# EasyEDA Pro project OV-Watch_V2.4_LCProject_2024-05-25.epro, schematic back

## Sheets
1 sensor: Create Date: 2023-07-01; Page Name: sensor; Project Name: OV-Watch_V2.4; Schematic Name: Back; Update Date: 2023-07-01; Company: GDUT; Drawed: Kingham; Page Size: A4; Reviewed: Kingham; Version: V2.0
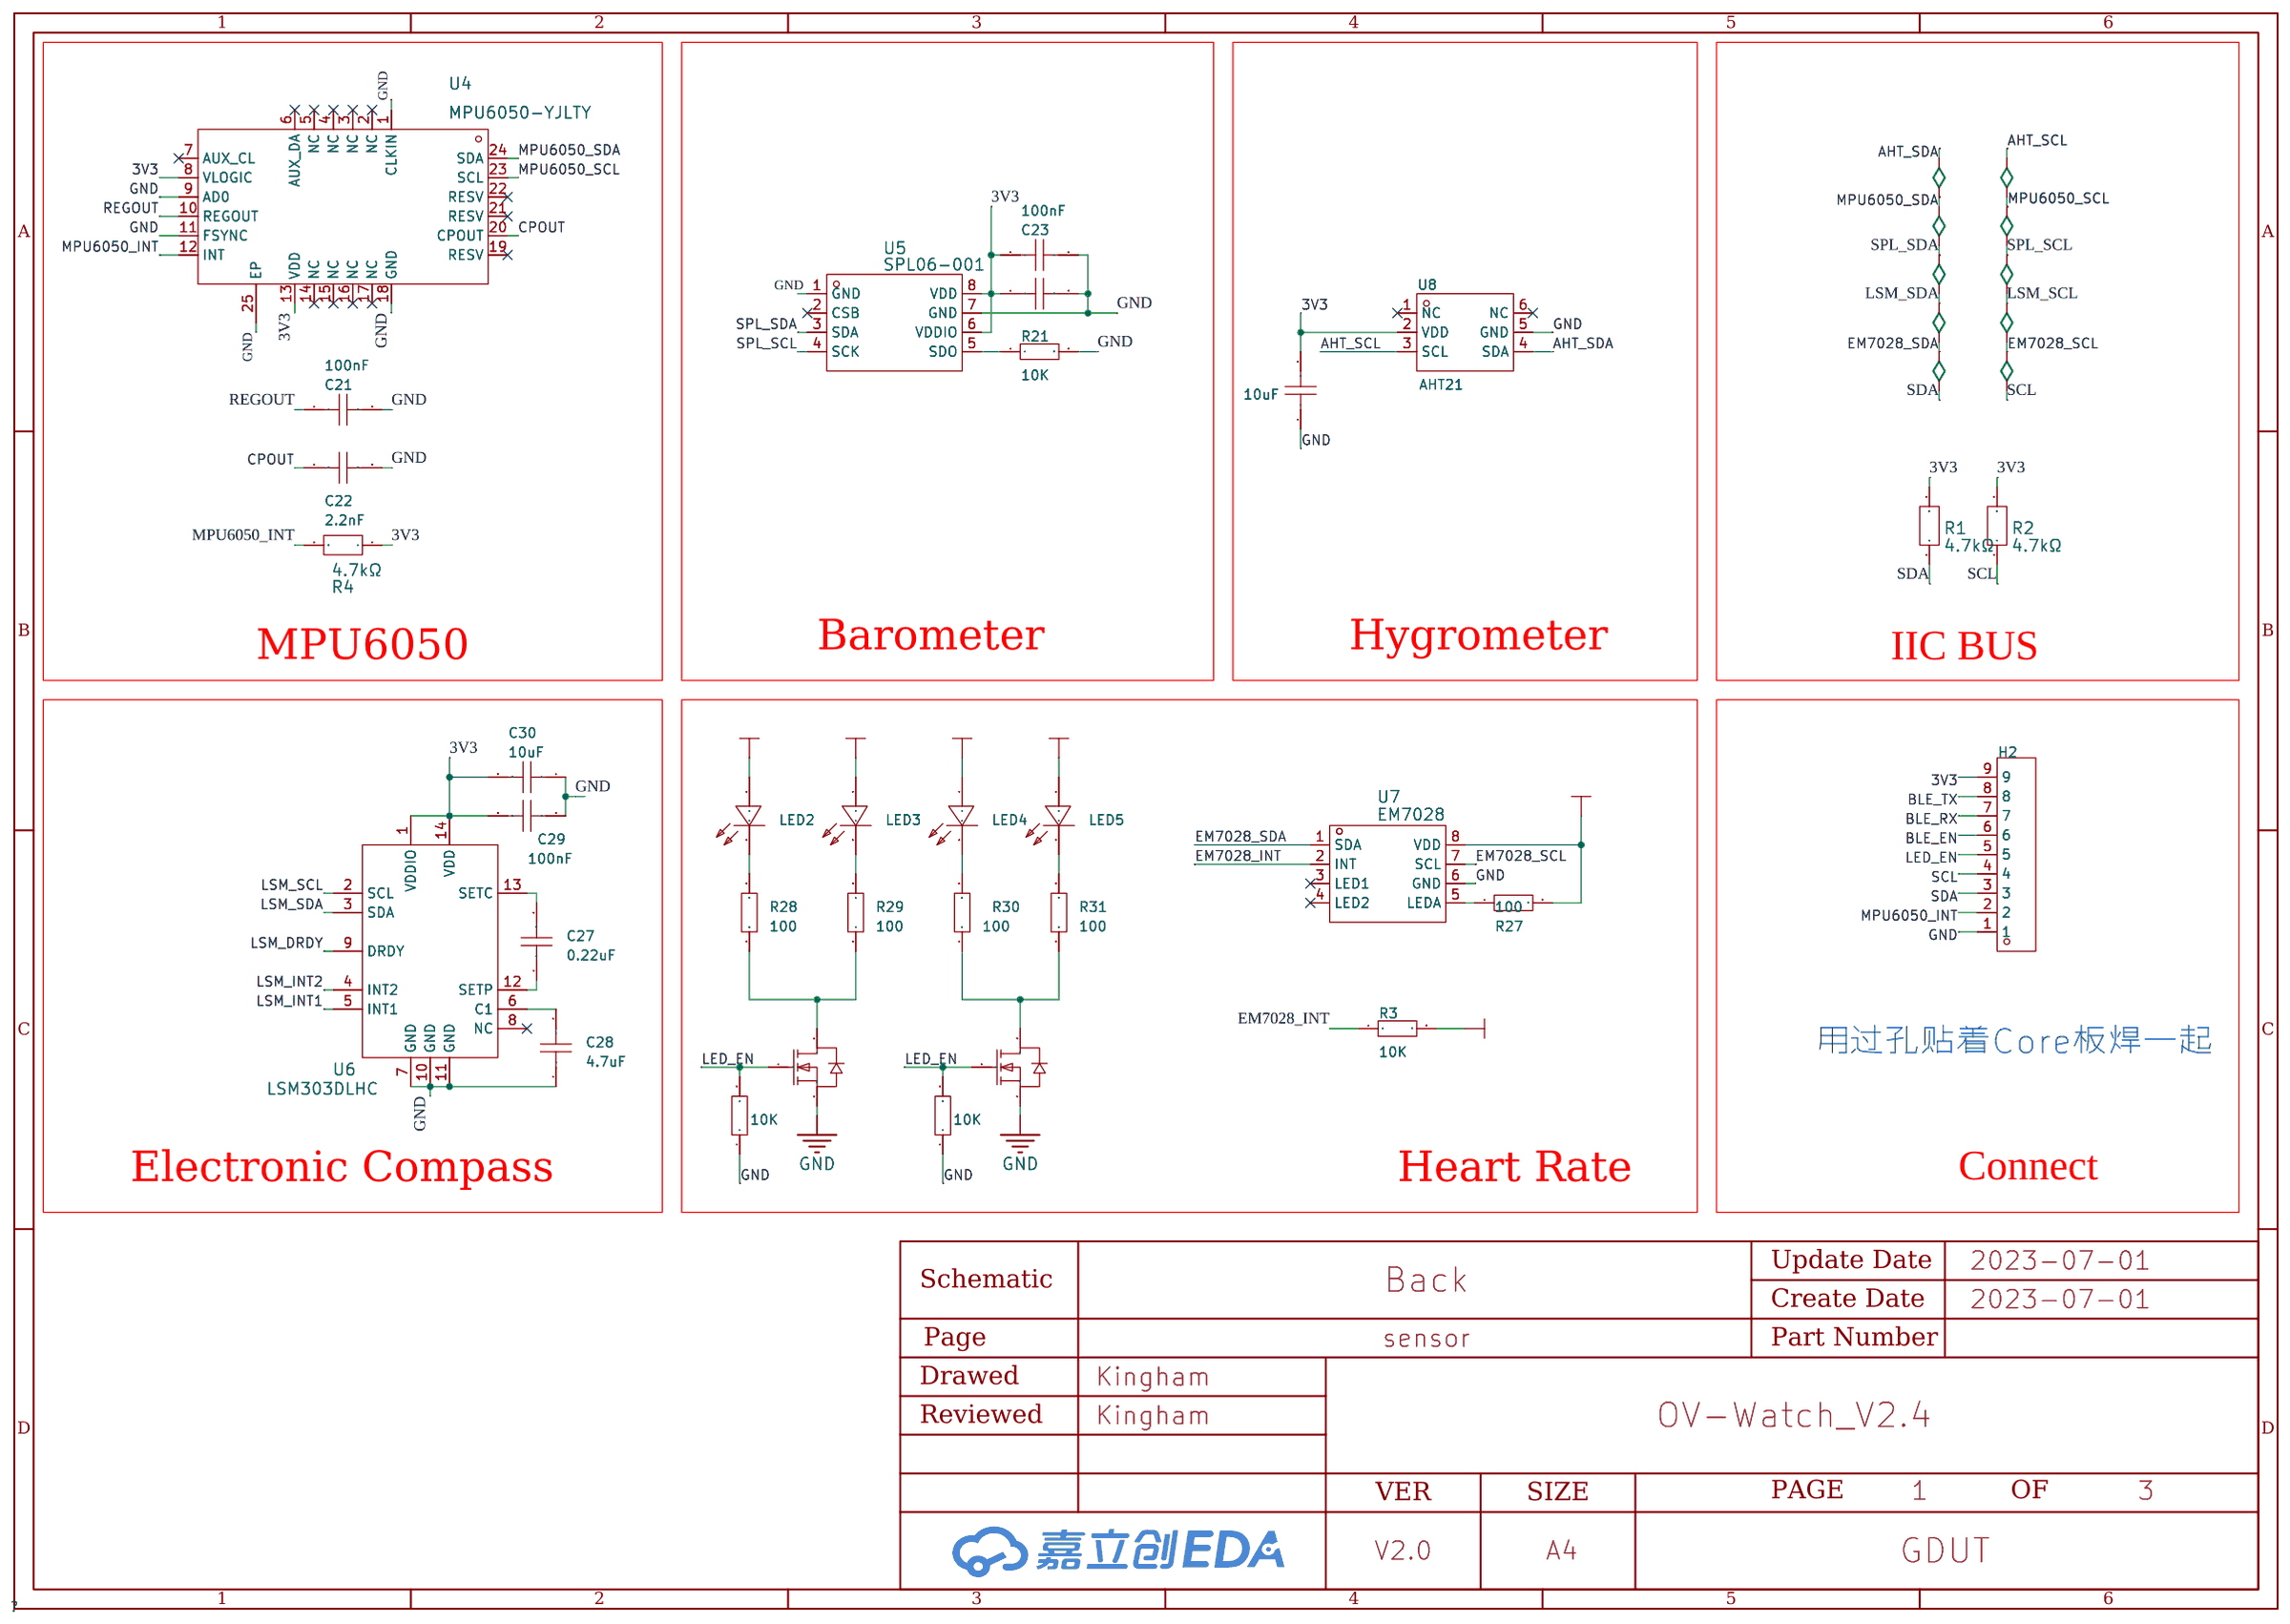
[diagram p0: sensor]
2 充电盘: Create Date: 2023-03-03; Page Name: 充电盘; Project Name: OV-Watch_V2.3_2023-4-1; Update Date: 2023-06-02; Company: 嘉立创EDA; Version: V1.0
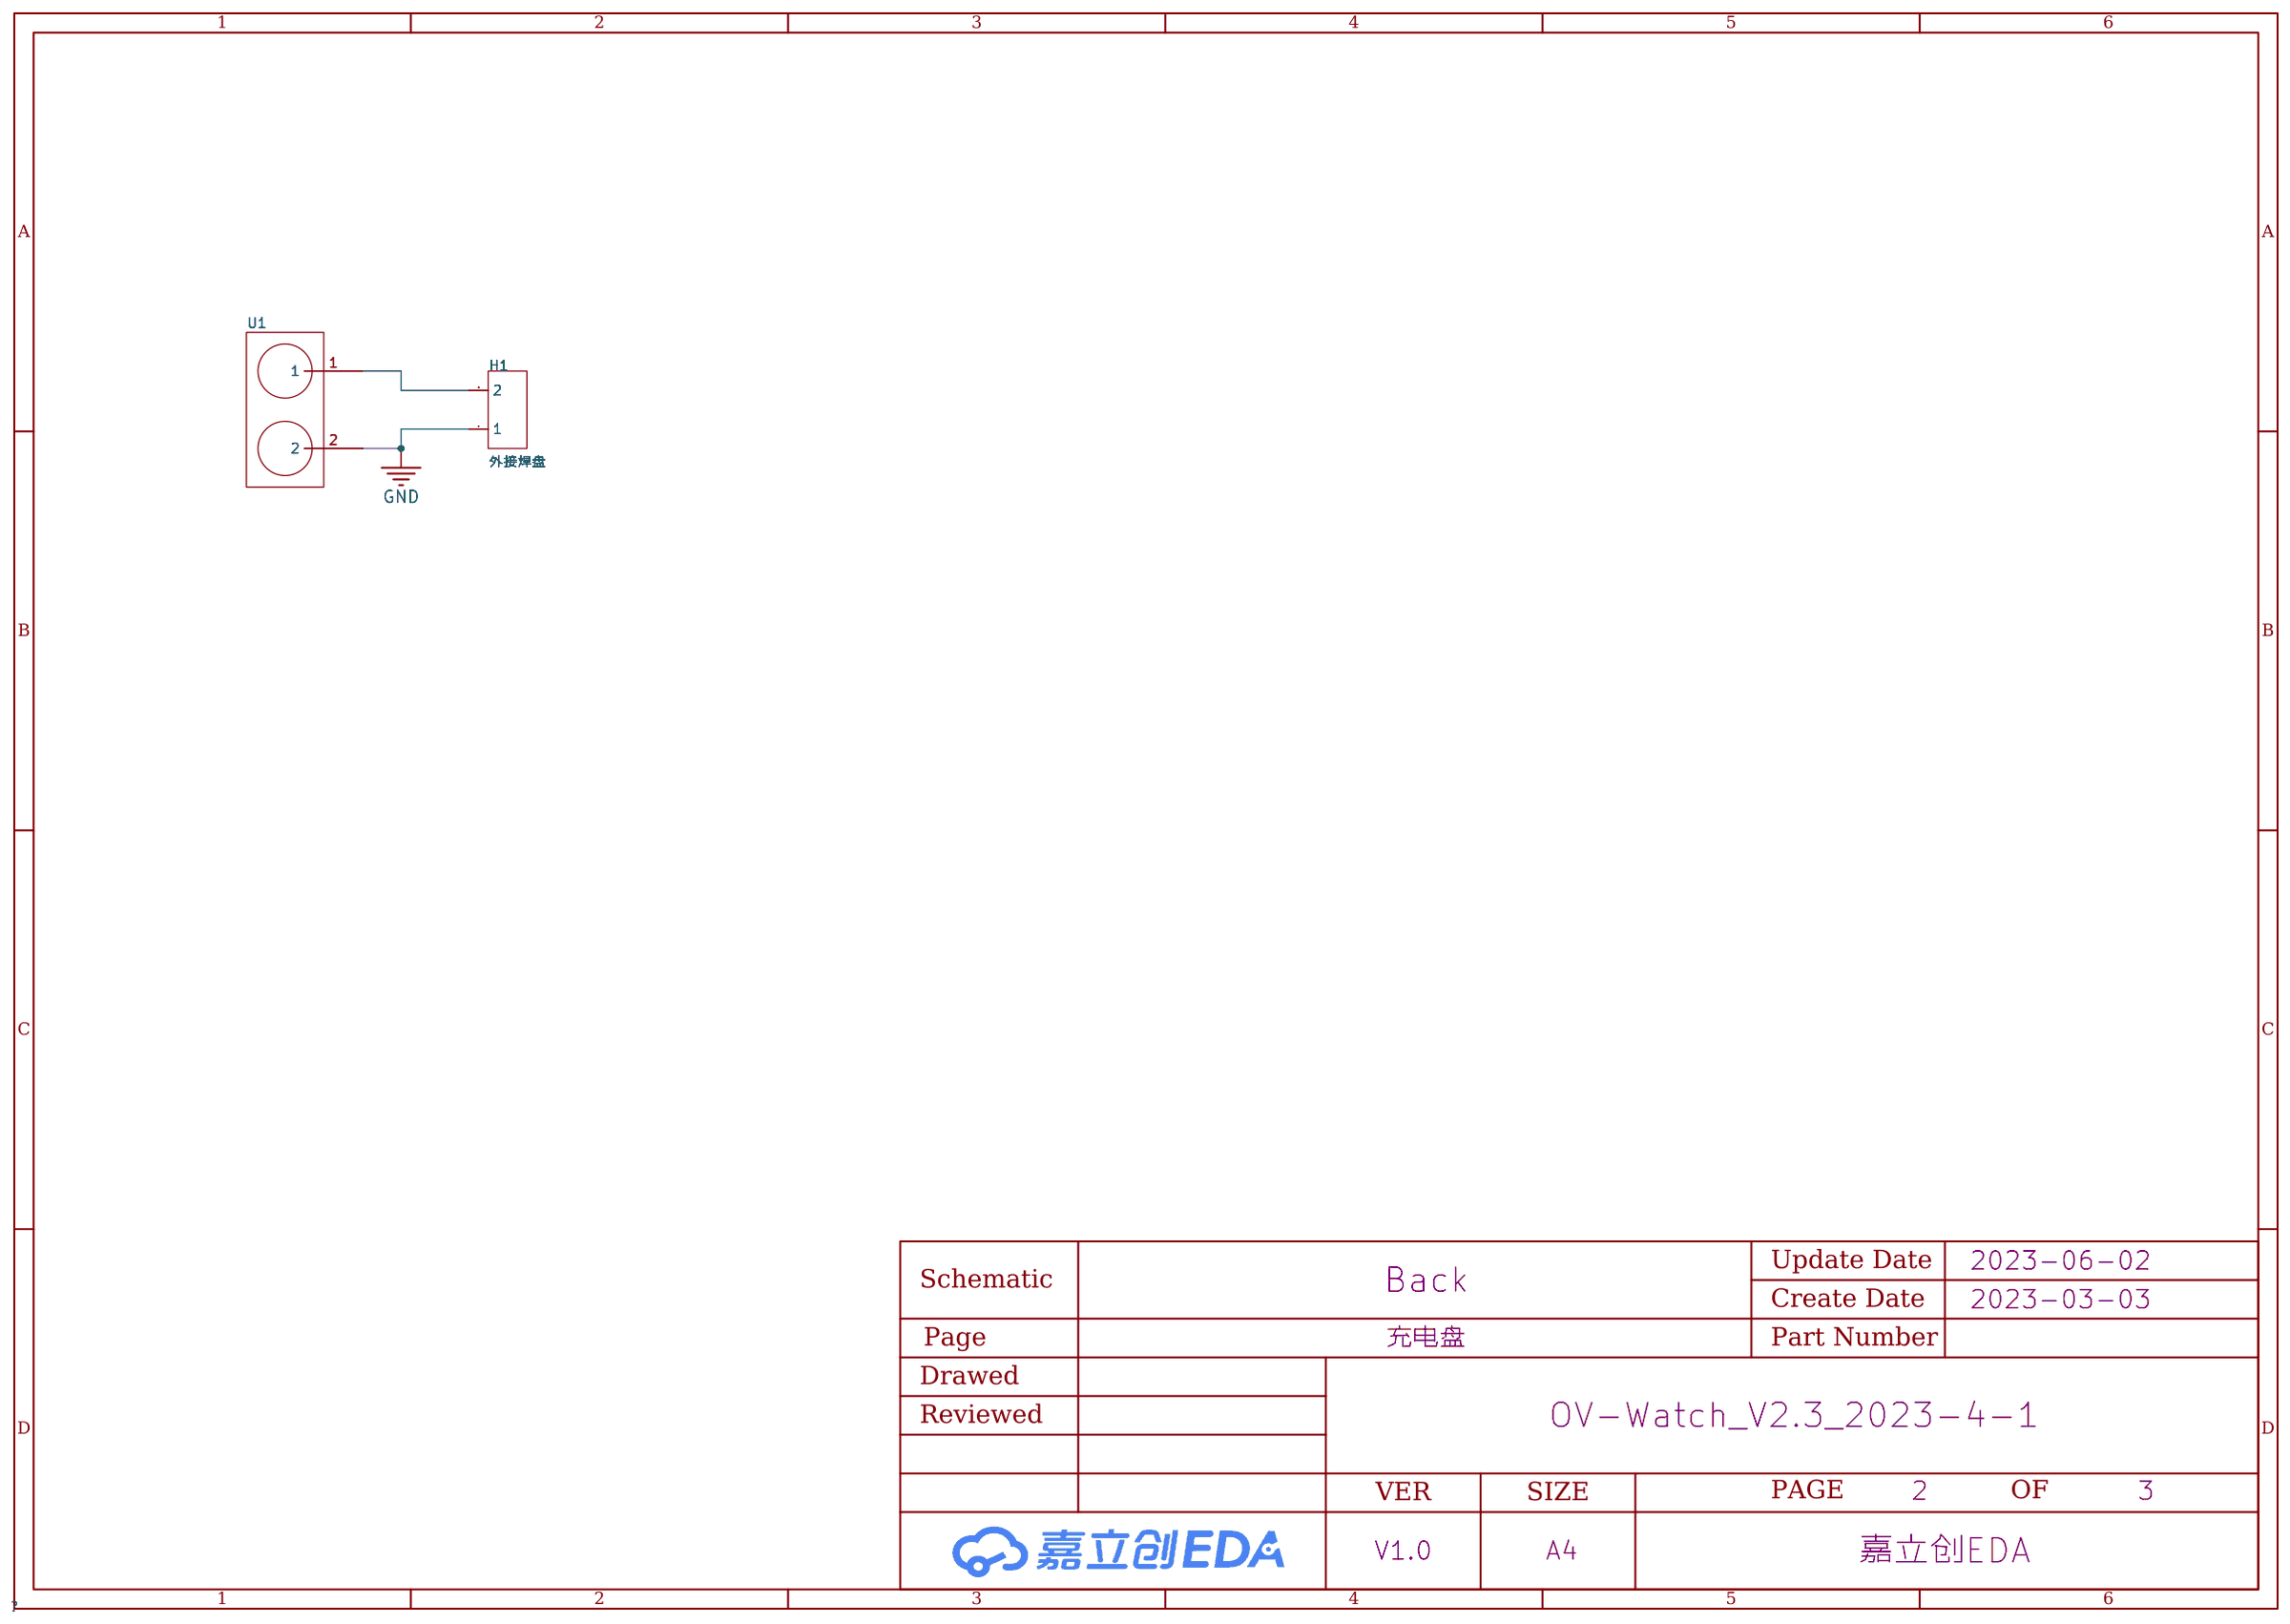
[diagram p1: 充电盘]
3 BLE: Page Name: BLE; Update Date: 2024-05-19; Company: 嘉立创EDA; Version: V1.0
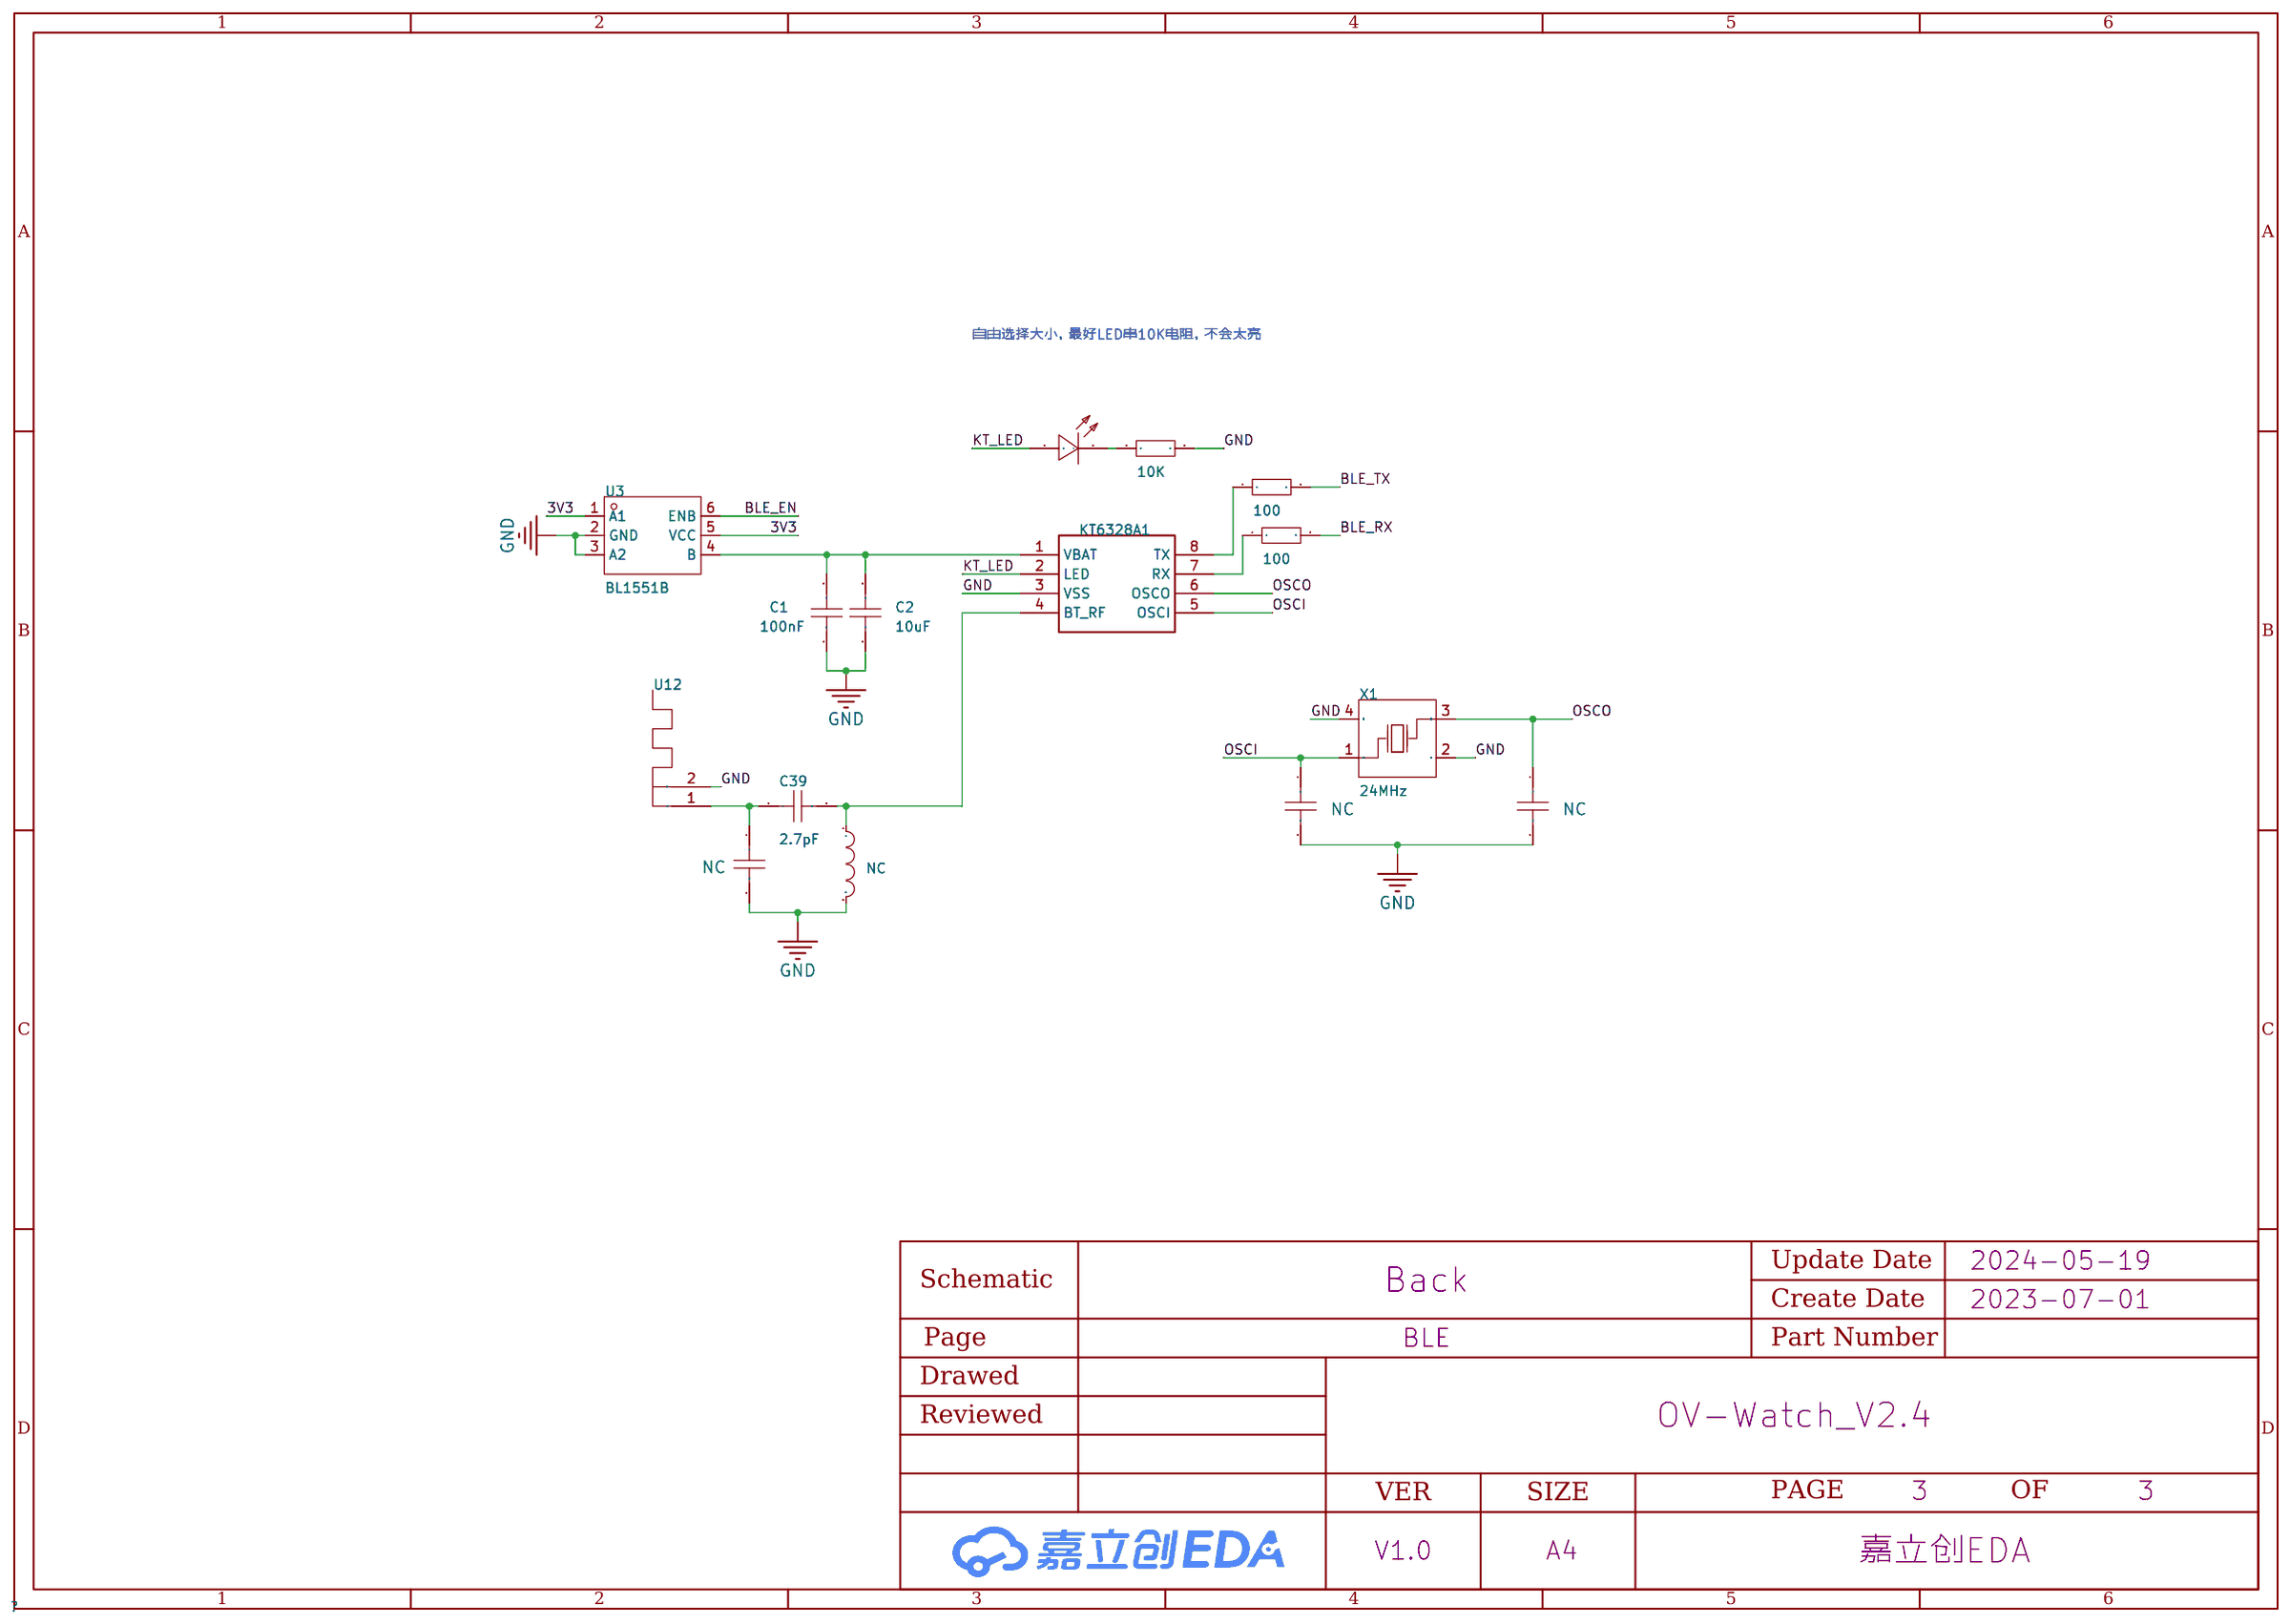
[diagram p2: BLE]

## Parts
sheet BLE
C1  100nF  [C0402]
C2  10uF  [C0402]
C37  NC  [C0402]
C39  2.7pF  [C0402]
C40  NC  [C0402]
C41  NC  [C0402]
KT6328A1  -  [KT6328A-SOP8]
L1  NC  [L0402]
LED1  SZYY0805R  [LED0805-R-RD]
R18  10K  [R0402]
R23  100  [R0402]
R24  100  [R0402]
U3  BL1551B  [SC-70-6_L2.1-W1.3-P0.65-LS2.3-BR]
U12  -  [通用蓝牙天线]
X1  24MHz  [OSC-SMD_4P-L3.2-W2.5-BL_KYOCERA_KC3225A]
sheet sensor
C21  100nF  [C0402]
C22  2.2nF  [C0402]
C23  100nF  [C0402]
C24  100nF  [C0402]
C27  0.22uF  [C0402]
C28  4.7uF  [C0402]
C29  100nF  [C0402]
C30  10uF  [C0402]
C31  10uF  [C0402]
H2  -  [HDR-TH_9P-P2.54-V-M]
LED2  ORH-G36G  [LED0603-R-RD]
LED3  ORH-G36G  [LED0603-R-RD]
LED4  ORH-G36G  [LED0603-R-RD]
LED5  ORH-G36G  [LED0603-R-RD]
R1  4.7kΩ  [R0402]
R2  4.7kΩ  [R0402]
R3  10K  [R0402]
R4  4.7kΩ  [R0402]
R21  10K  [R0402]
R27  100  [R0402]
R28  100  [R0402]
R29  100  [R0402]
R30  100  [R0402]
R31  100  [R0402]
R32  10K  [R0402]
R33  10K  [R0402]
U2  2N7002  [SOT-23-3_L2.9-W1.3-P1.90-LS2.4-BR]
U4  MPU6050-YJLTY  [QFN-24_L4.0-W4.0-P0.50-BL-EP2.7]
U5  SPL06-001  [SENSOR-SMD_SPL06-001]
U6  LSM303DLHC  [LGA-14]
U7  EM7028  [DFN-8_L4.2-W1.4-P0.95-TL]
U8  AHT21  [SENSOR-SMD_L3.0-W3.0-P1.00-BR]
U13  2N7002  [SOT-23-3_L2.9-W1.3-P1.90-LS2.4-BR]
sheet 充电盘
H1  外接焊盘  [HDR-TH_2P-P2.54-V-M-1]
U1  -  [磁吸充电盘2pinX2.84]

## Library data of the parts
C1 C2 C21-C24 C27-C31 C39 = CAP_0402: Supplier Footprint: 0402
C37 C40 C41 = 0.1uF: link: https://item.szlcsc.com/15869.html; 3DModel: C0402_L1.0-W0.5-H0.5
KT6328A1 = KT6328A-SOP8
L1 = L_0402
LED1 = SZYY0805R: 发光颜色:红灯;二极管配置:-;透镜颜色:无色透明;主波长:615nm~630nm;峰值波长:645nm;色温:-;光通量(25时):-;测试电流:10mA;正向电压(VF):2.4V;发光强度:120mcd;功率:40mW;发光角度:120°;安装方式:-;工作温度:-40~+85;; LCSC Part Name: 红灯; Supplier Part: C434431; Manufacturer: yongyu(永裕光电); Supplier Footprint: 0805; JLCPCB Part Class: ExtendedPart; Datasheet: https://atta.szlcsc.com/upload/public/pdf/source/20191204/C434431_431C171B758FE4C37FA40B1B295AA7AB.pdf; Supplier: LCSC; Emitted Color: 红灯; Lens Color: 无色透明; Dominant Wavelength: 615nm~630nm; Peak Wavelength: 645nm; Forward Current: 10mA; Forward Voltage (VF): 2.4V; Luminous Intensity: 120mcd; Power Dissipation: 40mW; Viewing Angle: 120°; Operating Temperature: -40~+85
R3 R18 R21 R23 R24 R27-R33 = Res_0402: Supplier Footprint: 0402
U3 = BL1551B: Supplier Part: C2944066; Manufacturer: BL(上海贝岭); Supplier Footprint: SC-70-6; JLCPCB Part Class: ExtendedPart; Datasheet: https://atta.szlcsc.com/upload/public/pdf/source/20220111/7C5AAA5FC97DA844C85990CC55D99B47.pdf; Supplier: LCSC
U12 = 蓝牙天线: _: undefined
X1 = SX32Y024000BC1T: 频率:-;负载电容:-;; LCSC Part Name: 322524M12PF10ppm-20-75℃; Supplier Part: C271629; Manufacturer: TKD(泰晶); Supplier Footprint: SMD3225-4P; JLCPCB Part Class: ExtendedPart; Datasheet: https://atta.szlcsc.com/upload/public/pdf/source/20180829/C271629_CA81D930E8823EB83EE4F79A596DDEFE.pdf; Supplier: LCSC
H2 = DZ254R-11-09-63: 排数:单排;总PIN位数:9;间距:2.54mm;插针结构:1x9P;行距:-;安装类型:直插;圆针/方针:方针;额定电流:3A;额定电压:-;配合针长度:6mm;塑高:2.54mm;端接针长度:3mm;工作温度范围:-;颜色:-;; LCSC Part Name: 2.54mm1x9P直插方针; Supplier Part: C2935915; Manufacturer: DEALON(德艺隆); Supplier Footprint: 插件,P=2.54mm; JLCPCB Part Class: ExtendedPart; Datasheet: https://atta.szlcsc.com/upload/public/pdf/source/20211231/575FA3133C71038A037ABECAE7869EE6.pdf; Supplier: LCSC; Number of Rows: 单排; Number of Pins: 9; Pitch: 2.54mm; Pin Structure: 1x9P; Mounting Type: 直插; Circluar Pins/Square Pins: 方针; Current Rating (Max): 3A; Length of Mating Pin: 6mm; Insulation Height: 2.54mm; Length of End Connection Pin: 3mm
LED2-LED5 = ORH-G36G: 发光颜色:翠绿;二极管配置:-;主波长:510nm~525nm;色温:-;光通量(25℃时):-;发光强度:140mcd~315mcd;功率:100mW;安装方式:-;; LCSC Part Name: 翠绿光强140mcd~315mcd消费级; Supplier Part: C205443; Manufacturer: Orient(奥伦德); Supplier Footprint: 0603; JLCPCB Part Class: ExtendedPart; Datasheet: https://atta.szlcsc.com/upload/public/pdf/source/20180403/C205443_FC3A450D702BEC6084FEB8CF87A0695F.pdf; Supplier: LCSC; Emitted Color: 翠绿; Lens Color: 无色透明; Dominant Wavelength: 510nm~525nm; Peak Wavelength: 525nm; Forward Current: 5mA; Forward Voltage (VF): 2.6V~3.2V; Luminous Intensity: 140mcd~315mcd; Power Dissipation: 100mW; Viewing Angle: 130°; Operating Temperature: -40℃~+85℃
R1 R2 R4 = 0402WGF4701TCE: 电阻类型:厚膜电阻;阻值:4.7kΩ;精度:±1%;功率:62.5mW;; LCSC Part Name: 4.7kΩ±1%62.5mW; Supplier Part: C25900; Manufacturer: UNI-ROYAL(厚声); Supplier Footprint: 0402; JLCPCB Part Class: BasicPart; Datasheet: https://atta.szlcsc.com/upload/public/pdf/source/20200306/C422600_1E6D84923E4A46A82E41ADD87F860B5C.pdf; Supplier: LCSC; Type: 厚膜电阻; Tolerance: ±1%; Power(Watts): 62.5mW; Temperature Coefficient: ±100ppm/℃; Overload Voltage (Max): 50V; Operating Temperature Range: -55℃~+155℃; link: https://item.szlcsc.com/323315.html; 3DModel: R0402_L1.0-W0.5-H0.5
U2 U13 = 2N7002: 类型:-;漏源电压(Vdss):-;连续漏极电流(Id):-;功率(Pd):-;导通电阻(RDS(on)@Vgs,Id):-;阈值电压(Vgs(th)@Id):-;栅极电荷(Qg@Vgs):-;输入电容(Ciss@Vds):-;反向传输电容(Crss@Vds):-;; Supplier Part: C727149; Manufacturer: TWGMC(台湾迪嘉); Supplier Footprint: SOT-23; JLCPCB Part Class: ExtendedPart; Datasheet: https://atta.szlcsc.com/upload/public/pdf/source/20200827/C727149_F88DE2A79720D5B1ACE833184507B038.pdf; Supplier: LCSC
U4 = MPU6050-YJLTY: link: https://item.szlcsc.com/245167.html; 3DModel: QFN-24_L4.0-W4.0-H0.9-P0.50-; Supplier: LCSC; Supplier Part: C2912107; Manufacturer: null; JLCPCB Part Class: ExtendedPart
U5 = SPL06-001: link: https://item.szlcsc.com/2782076.html; Supplier: LCSC; Supplier Part: C2684428; Manufacturer: Goertek(歌尔); JLCPCB Part Class: ExtendedPart
U6 = LSM303DLHC: license: https://www.gnu.org/licenses/lgpl-2.1.html
U7 = EM7028: link: https://item.szlcsc.com/92667.html; 3DModel: DFN-8_L4.2-W2.4-H1.4P0.95-TL; Supplier: LCSC; Manufacturer: EPTICORE; Supplier Part: C91478; JLCPCB Part Class: ExtendedPart
U8 = AHT21: 传感器类型:-;输出类型:-;温度范围:-;湿度范围:-;精度:-;; Supplier Part: C2827328; Manufacturer: 广州奥松; Supplier Footprint: SMD3x3; JLCPCB Part Class: ExtendedPart; Datasheet: https://atta.szlcsc.com/upload/public/pdf/source/20210416/C2827328_0E7E1F5A52E8C31F9EEA54660EEC8C04.pdf; Supplier: LCSC
H1 = 826629-2: 间距:2.54mm;总PIN位数:2;排数:1;插针结构:1x2P;行距:-;安装类型:直插;圆针/方针:-;额定电流:-;额定电压:-;配合针长度:-;塑高:2.8mm;触头材质:黄铜;触头镀层:-;颜色:绿色;; LCSC Part Name: 2.54mm1x2P直插分离式金; Supplier Part: C86471; Manufacturer: TEConnectivity(美国泰科); Supplier Footprint: 插件,P=2.54mm; JLCPCB Part Class: ExtendedPart; Datasheet: https://atta.szlcsc.com/upload/public/pdf/source/20161105/1478330325829.pdf; Supplier: LCSC; Pitch: 2.54mm; Number of Pins: 2; Number of Rows: 1; Pin Structure: 1x2P; Mounting Type: 直插; Insulation Height: 2.8mm; Contact Material: 黄铜; Color: 绿色
U1 = 磁吸充电盘2pinX2.84

## Nets
3V3: C23.1 C24.1 C29.2 C30.2 C31.2 H2.9 LED2.1(A) LED3.1(A) LED4.1(A) LED5.1(A) R1.2 R2.2 R3.2 R4.1 R27.2 U3.1(A1) U3.5(VCC) U4.8(VLOGIC) U4.13(VDD) U5.6(VDDIO) U5.8(VDD) U6.1(VDDIO) U6.14(VDD) U7.8(VDD) U8.2(VDD)
GND: C1.1 C2.1 C21.2 C22.2 C23.2 C24.2 C28.1 C29.1 C30.1 C31.1 C37.2 C40.2 C41.2 H1.1 H2.1 KT6328A1.3(VSS) L1.2 R18.2 R21.2 R32.1 R33.1 U1.2 U2.2(S) U3.2(GND) U3.3(A2) U4.1(CLKIN) U4.9(AD0) U4.11(FSYNC) U4.18(GND) U4.25(EP) U5.1(GND) U5.7(GND) U6.7(GND) U6.10(GND) U6.11(GND) U7.6(GND) U8.5(GND) U12.2 U13.2(S) X1.2(GND) X1.4(GND)
AHT_SCL: H2.4 R2.1 U4.23(SCL) U5.4(SCK) U6.2(SCL) U7.7(SCL) U8.3(SCL)
AHT_SDA: H2.3 R1.1 U4.24(SDA) U5.3(SDA) U6.3(SDA) U7.1(SDA) U8.4(SDA)
BLE_EN: H2.6 U3.6(ENB)
BLE_RX: H2.7 R24.2
BLE_TX: H2.8 R23.2
CPOUT: C22.1 U4.20(CPOUT)
EM7028_INT: R3.1 U7.2(INT)
KT_LED: KT6328A1.2(LED) LED1.1(+)
LED_EN: H2.5 R32.2 R33.2 U2.1(G) U13.1(G)
LSM_DRDY: U6.9(DRDY)
LSM_INT1: U6.5(INT1)
LSM_INT2: U6.4(INT2)
MPU6050_INT: H2.2 R4.2 U4.12(INT)
OSCI: C40.1 KT6328A1.5(OSCI) X1.1(OSC1)
OSCO: C41.1 KT6328A1.6(OSCO) X1.3(OSC2)
REGOUT: C21.1 U4.10(REGOUT)
$1N5774: R21.1 U5.5(SDO)
$1N5779: C28.2 U6.6(C1)
$1N5781: C27.2 U6.13(SETC)
$1N5782: C27.1 U6.12(SETP)
$1N24406: R27.1 U7.5(LEDA)
$1N24460: LED2.2(K) R28.2
$1N24534: LED3.2(K) R29.2
$1N24609: LED4.2(K) R30.2
$1N24611: R30.1 R31.1 U13.3(D)
$1N24684: LED5.2(K) R31.2
$1N24861: R28.1 R29.1 U2.3(D)
$2N277: H1.2 U1.1
$3N536: C1.2 C2.2 KT6328A1.1(VBAT) U3.4(B)
$3N3362: C37.1 C39.1 U12.1
$3N3704: KT6328A1.8(TX) R23.1
$3N3732: KT6328A1.7(RX) R24.1
$3N3781: LED1.2(-) R18.1
$3N4660: C39.2 KT6328A1.4(BT_RF) L1.1

Not connected (* = marked no-connect by the designer): U4 2(NC)* 3(NC)* 4(NC)* 5(NC)* 6(AUX_DA)* 7(AUX_CL)* 14(NC)* 15(NC)* 16(NC)* 17(NC)* 19(RESV)* 21(RESV)* 22(RESV)*; U5 2(CSB)*; U6 8(NC)*; U7 3(LED1)* 4(LED2)*; U8 1(NC)* 6(NC)*

## Notes on the sheets
sheet 1
- Barometer
- Hygrometer
- MPU6050
- IIC BUS
- 用过孔贴着Core板焊一起
- Electronic Compass
- Heart Rate
- Connect
sheet 3
- 自由选择大小，最好LED串10K电阻，不会太亮
